# Altium schematic sheet HiddenWiringDetector.SchDoc
size A4; SheetNumber: 1; SheetTotal: 1; SPICEModelCacheHKGFAYRM: <root> / <DocumentId>HKGFAYRM</DocumentId> / <CacheFrame Number="0"> / <Model Name="cap" Kind="MDL"> / <Text>*Default semiconductor capacitor / .MODEL CAP C()</Text> / </Model> / <Model Name="11dq03" Kind="MDL"> / <Text>*11DQ03 MCE 7-17-95 / *Ref: IR Power Semiconductors Product Digest '94 / *MCE 30V 1.1A pkg:DIODE0.4 1,2 / .MODEL 11DQ03 D(IS=5.18E-9 RS=0.146 N=0.878 TT=4.32E-6 CJO=1.18E-10 / + VJ=0.75 M=0.333 EG=0.69 XTI=2 BV=30 IBV=6.01E-6 )</Text> / </Model> / </CacheFrame> / </root>
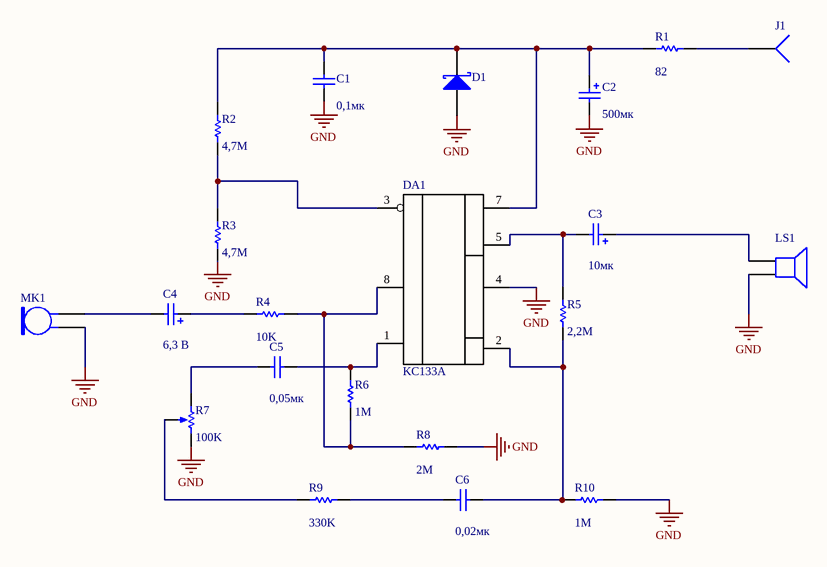
[diagram p0: HiddenWiringDetector.SchDoc]

## Parts
C1  value 0,1мк  [0402]  (hidden comment: Cap Semi)
C2  value 500мк  [POLAR0.8]  (hidden comment: Cap Pol2)
C3  value 10мк  [POLAR0.8]  (hidden comment: Cap Pol2)
C4  value 6,3 B  [POLAR0.8]  (hidden comment: Cap Pol2)
C5  value 0,05мк  [0402]  (hidden comment: Cap Semi)
C6  value 0,02мк  [0402]  (hidden comment: Cap Semi)
D1  Diode 11DQ03  [DO-204AL]  (value not drawn)
DA1  KC133A  [PCBComponent_1]
J1  Socket  [PIN1]  (value not drawn)
LS1  Speaker  [PIN2]  (value not drawn)
MK1  Mic2  [PIN2]  (value not drawn)
R1  value 82  [AXIAL-0.3]  (hidden comment: Res1)
R2  value 4,7М  [AXIAL-0.3]  (hidden comment: Res1)
R3  value 4,7М  [AXIAL-0.3]  (hidden comment: Res1)
R4  value 10K  [AXIAL-0.3]  (hidden comment: Res1)
R5  value 2,2М  [AXIAL-0.3]
R6  value 1М  [AXIAL-0.3]  (hidden comment: Res1)
R7  value 100K  [VR5]  (hidden comment: RPot)
R8  value 2М  [AXIAL-0.3]  (hidden comment: Res1)
R9  value 330K  [AXIAL-0.3]  (hidden comment: Res1)
R10  value 1М  [AXIAL-0.3]  (hidden comment: Res1)

## Nets
GND: C1.1 C2.2 D1.1(A) DA1.4 LS1.2 MK1.1 R3.1 R7.2(BOT) R8.1 R10.2
NetC1_2: C1.2 C2.1 D1.2(K) DA1.7 R1.2 R2.2
NetC3_1: C3.1 LS1.1
NetC3_2: C3.2 DA1.5 R5.1
NetC4_1: C4.1 R4.1
NetC4_2: C4.2 MK1.2
NetC5_1: C5.1 DA1.1 R6.2
NetC5_2: C5.2 R7.1(TOP)
NetC6_1: C6.1 DA1.2 R5.2 R10.1
NetC6_2: C6.2 R9.2
NetDA1_3: DA1.3 R2.1 R3.2
NetDA1_8: DA1.8 R4.2 R6.1 R8.2
NetJ1_1: J1.1 R1.1
NetR7_3: R7.3(TAP) R9.1

## Library data of the parts
C1 C5 C6 = Cap Semi: Capacitor (Semiconductor SIM Model); Published: 8-Jun-2000; LatestRevisionDate: 29-May-2009; LatestRevisionNote: IPC-7351 Footprint Added.; PackageReference: C1206; Publisher: Altium Limited; PackageDescription: Chip Capacitor
C2-C4 = Cap Pol2: Polarized Capacitor (Axial); Published: 8-Jun-2000; LatestRevisionDate: 17-Jul-2002; LatestRevisionNote: Re-released for DXP Platform.; PackageReference: POLAR0.8; Publisher: Altium Limited; PackageDescription: Polarized Capacitor; 2 Leads
D1 = Diode 11DQ03: Schottky Rectifier; Published: 8-Jun-2000; LatestRevisionDate: 17-Jul-2002; LatestRevisionNote: Re-released for DXP Platform.; DatasheetVersion: Dec-1997; PackageReference: DO-204AL; Publisher: Altium Limited; PackageDescription: Diode, Axial; Body 5.2 x 2.7 mm (LxDia. max), Lead Dia. 0.86 mm (max); Code_JEDEC: DO-204-AL; ComponentLink1Description: Manufacturer Link; ComponentLink1URL: http://www.irf.com/; ComponentLink2Description: Datasheet; ComponentLink2URL: http://www.irf.com/product-info/datasheets/data/11dq03.pdf
LS1 = Speaker: Loudspeaker; Published: 24-Mar-1999; LatestRevisionDate: 17-Jul-2002; LatestRevisionNote: Re-released for DXP Platform.; PackageReference: PIN2; Publisher: Altium Limited
MK1 = Mic2: Microphone; Published: 24-Mar-1999; LatestRevisionDate: 17-Jul-2002; LatestRevisionNote: Re-released for DXP Platform.; PackageReference: PIN2; Publisher: Altium Limited
R1-R6 R8-R10 = Res1: Resistor; Published: 8-Jun-2000; LatestRevisionDate: 17-Jul-2002; LatestRevisionNote: Re-released for DXP Platform.; PackageReference: AXIAL-0.3; Publisher: Altium Limited; PackageDescription: Axial Device, Thru-Hole; 2 Leads; 0.3 in Pin Spacing
R7 = RPot: Potentiometer; Sim Note: Enter the Resistance value and the set point into parameter fields.; Set Position: 0.5; Published: 8-Jun-2000; LatestRevisionDate: 17-Jul-2002; LatestRevisionNote: Re-released for DXP Platform.; PackageReference: VR5; Publisher: Altium Limited; PackageDescription: Variable Resistor, Thru-Hole; 3 Leads
J1 = Socket: LatestRevisionDate: 17-Jul-2002; LatestRevisionNote: Re-released for DXP Platform.; Publisher: Altium Limited